# Altium schematic sheet 总电路图2.SchDoc
size A3; Organization: Altium Limited; Address1: L3, 12a Rodborough Rd; Address2: Frenchs Forest; Address3: NSW; Address4: Australia 2086
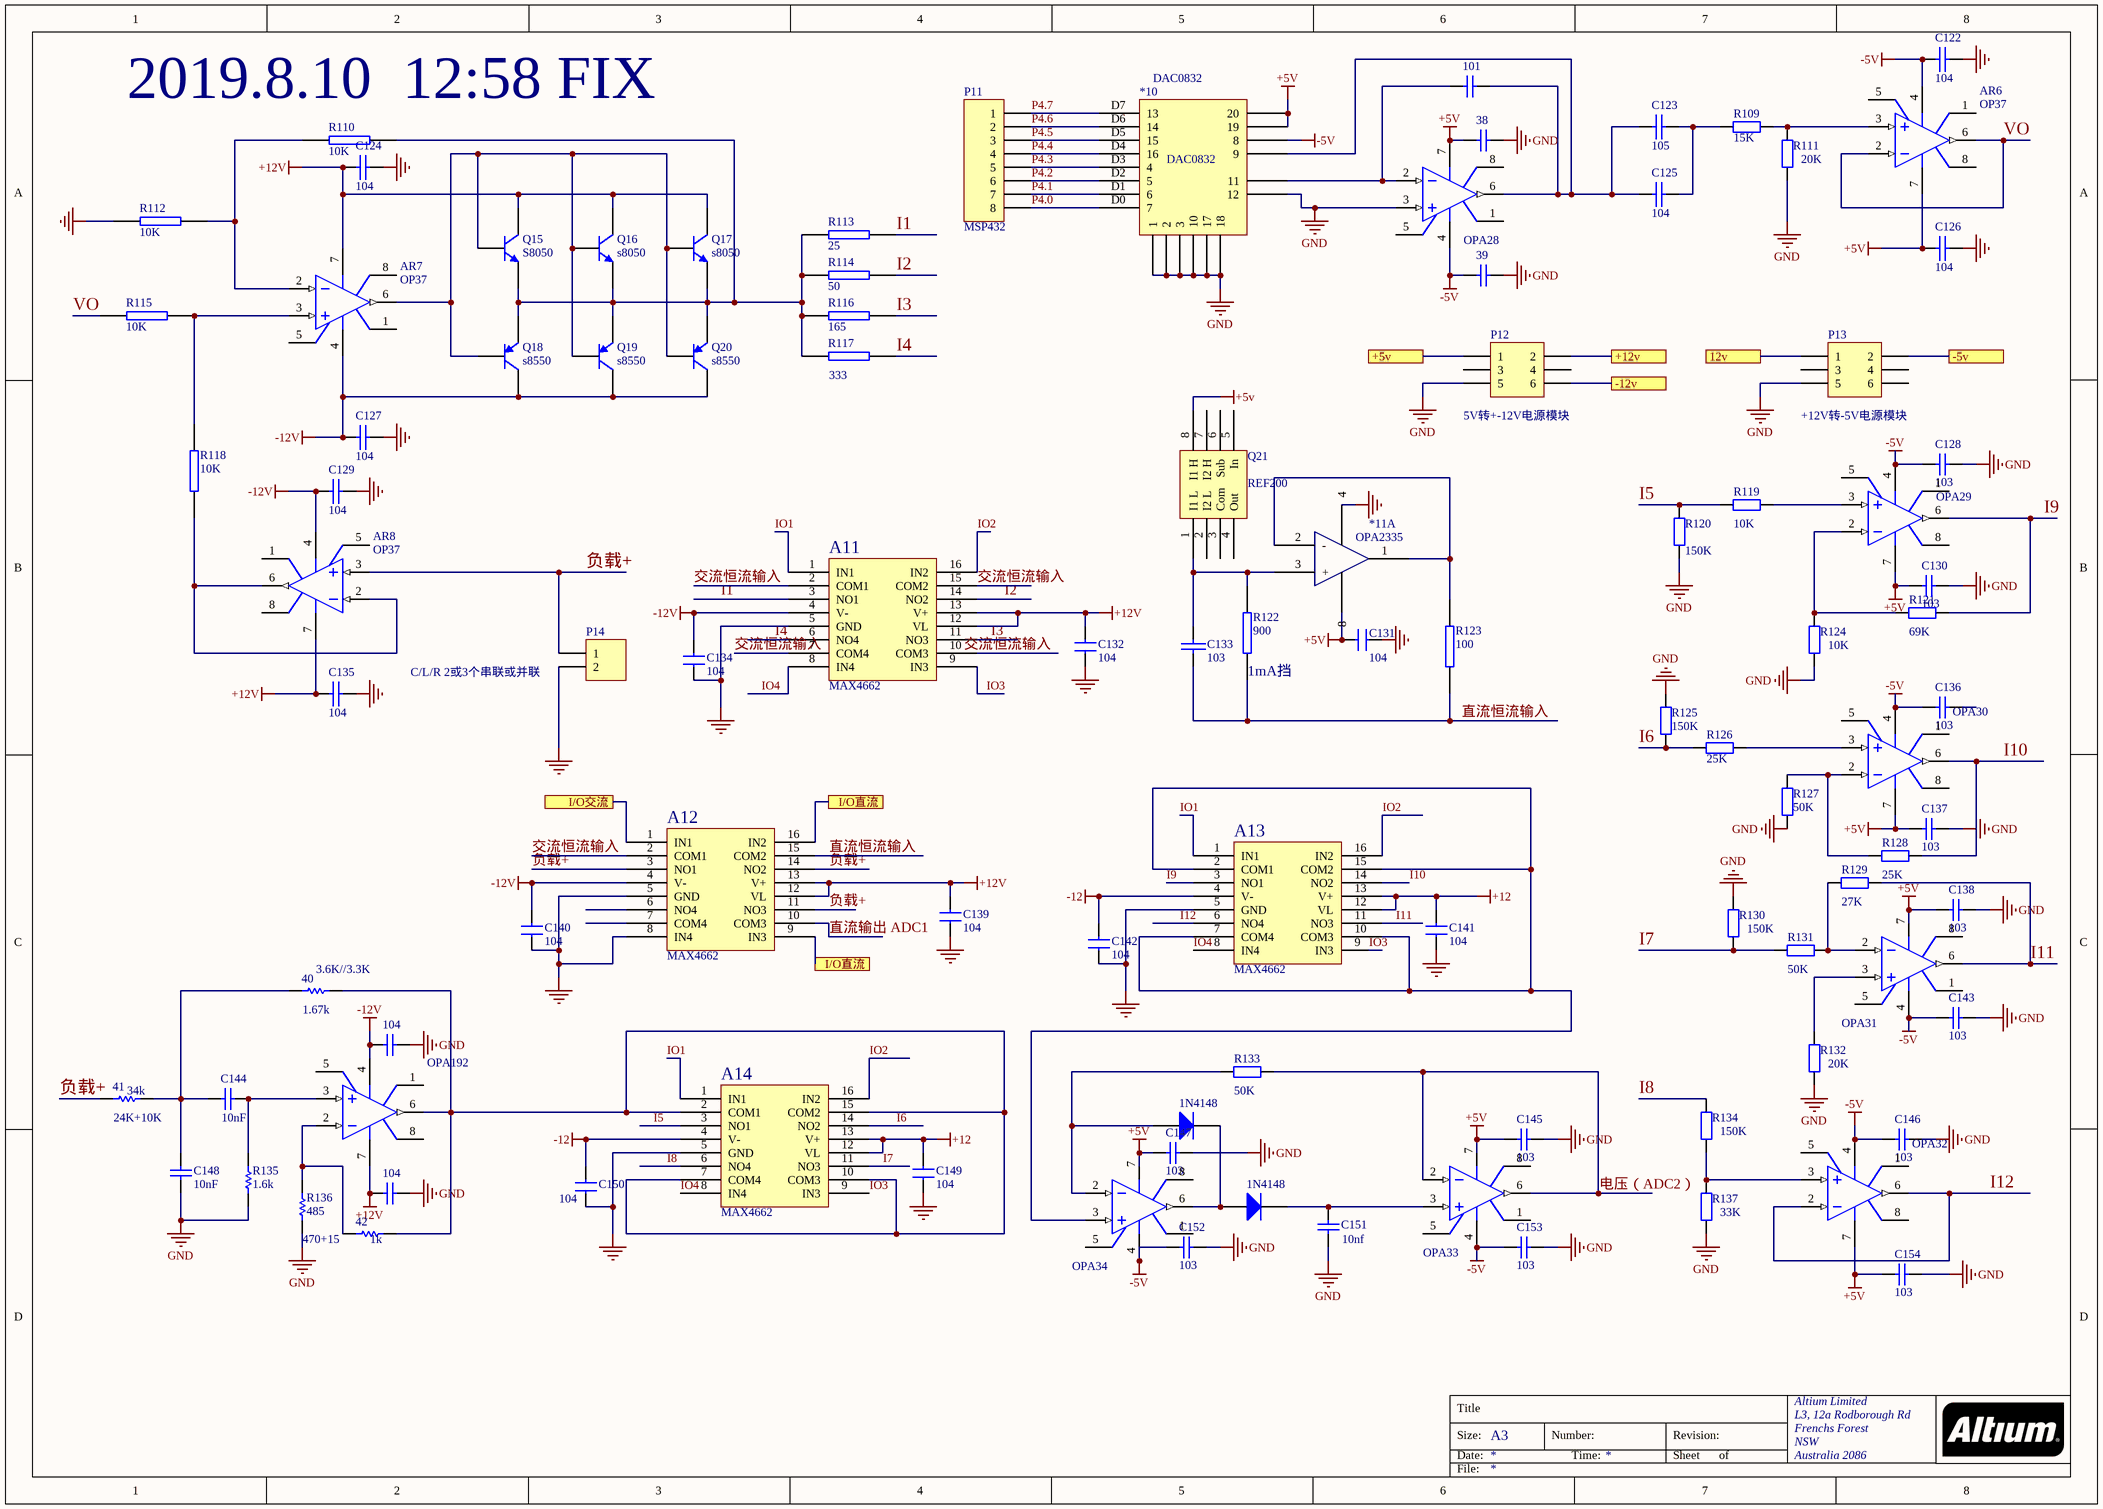
[diagram p0: 总电路图2.SchDoc]

## Parts
(Parts that share a designator on the sheet are numbered #1, #2 ... from top to bottom, then left to right.)
1N4148#1  Diode 1N4001  [DO-41]  (value not drawn)
1N4148#2  Diode 1N4001  [DO-41]  (value not drawn)
38  Cap  [RAD-0.3]  (value not drawn)
39  Cap  [RAD-0.3]  (value not drawn)
40  value 1.67k  [AXIAL-0.3]  (hidden comment: Res1)
41  value 34k  [AXIAL-0.3]  (hidden comment: Res1)
42  value 1k  [AXIAL-0.3]  (hidden comment: Res1)
101  Cap  [RAD-0.3]  (value not drawn)
104#1  Cap  [RAD-0.3]  (value not drawn)
104#2  Cap  [RAD-0.3]  (value not drawn)
*10  DAC0832
*11  OPA2335  (part A of 2)
A11  MAX4662  [DIP16-300_MH]
A12  MAX4662  [DIP16-300_MH]
A13  MAX4662  [DIP16-300_MH]
A14  MAX4662  [DIP16-300_MH]
AR6  OP37  [H-08A]
AR7  OP37  [H-08A]
AR8  OP37  [H-08A]
C122  104
C123  105
C124  104
C125  104
C126  104
C127  104
C128  value 103  [RAD-0.3]  (hidden comment: Cap)
C129  104
C130  value 103  [RAD-0.3]  (hidden comment: Cap)
C131  104  [RAD0.1]
C132  104  [RAD0.1]
C133  103
C134  104  [RAD0.1]
C135  104
C136  value 103  [RAD-0.3]  (hidden comment: Cap)
C137  value 103  [RAD-0.3]  (hidden comment: Cap)
C138  value 103  [RAD-0.3]  (hidden comment: Cap)
C139  104  [RAD0.1]
C140  104  [RAD0.1]
C141  104  [RAD0.1]
C142  104  [RAD0.1]
C143  value 103  [RAD-0.3]  (hidden comment: Cap)
C144  value 10nF  [RAD-0.3]  (hidden comment: Cap)
C145  value 103  [RAD-0.3]  (hidden comment: Cap)
C146  value 103  [RAD-0.3]  (hidden comment: Cap)
C147  value 103  [RAD-0.3]  (hidden comment: Cap)
C148  value 10nF  [RAD-0.3]  (hidden comment: Cap)
C149  104  [RAD0.1]
C150  104  [RAD0.1]
C151  value 10nf  [RAD-0.3]  (hidden comment: Cap)
C152  value 103  [RAD-0.3]  (hidden comment: Cap)
C153  value 103  [RAD-0.3]  (hidden comment: Cap)
C154  value 103  [RAD-0.3]  (hidden comment: Cap)
OPA28  Op Amp  [H-08A]  (value not drawn)
OPA29  Op Amp  [H-08A]  (value not drawn)
OPA30  Op Amp  [H-08A]  (value not drawn)
OPA31  Op Amp  [H-08A]  (value not drawn)
OPA32  Op Amp  [H-08A]  (value not drawn)
OPA33  Op Amp  [H-08A]  (value not drawn)
OPA34  Op Amp  [H-08A]  (value not drawn)
OPA192  Op Amp  [H-08A]  (value not drawn)
P11  MSP432  [HDR1X8]
P12  5V转+-12V电源模块  [HDR2X3]
P13  +12V转-5V电源模块  [HDR2X3]
P14  C/L/R 2或3个串联或并联  [HDR1X2H]
Q15  S8050  [TO-92A]
Q16  s8050  [TO-92A]
Q17  s8050  [TO-92A]
Q18  s8550  [TO-92A]
Q19  s8550  [TO-92A]
Q20  s8550  [TO-92A]
Q21  REF200
R109  value 15K  [AXIAL-0.4]  (hidden comment: Res2)
R110  10K  [RS 1/4W]
R111  value 20K  [AXIAL-0.4]  (hidden comment: Res2)
R112  10K  [RS 1/4W]
R113  25  [RS 1/4W]
R114  50  [RS 1/4W]
R115  10K  [RS 1/4W]
R116  165  [RS 1/4W]
R117  333  [RS 1/4W]
R118  10K  [RS 1/4W]
R119  value 10K  [AXIAL-0.4]  (hidden comment: Res2)
R120  value 150K  [AXIAL-0.4]  (hidden comment: Res2)
R121  value 69K  [AXIAL-0.4]  (hidden comment: Res2)
R122  900  [RS 1/4W]
R123  100  [RS 1/4W]
R124  value 10K  [AXIAL-0.4]  (hidden comment: Res2)
R125  value 150K  [AXIAL-0.4]  (hidden comment: Res2)
R126  value 25K  [AXIAL-0.4]  (hidden comment: Res2)
R127  value 50K  [AXIAL-0.4]  (hidden comment: Res2)
R128  value 25K  [AXIAL-0.4]  (hidden comment: Res2)
R129  value 27K  [AXIAL-0.4]  (hidden comment: Res2)
R130  value 150K  [AXIAL-0.4]  (hidden comment: Res2)
R131  value 50K  [AXIAL-0.4]  (hidden comment: Res2)
R132  value 20K  [AXIAL-0.4]  (hidden comment: Res2)
R133  value 50K  [AXIAL-0.4]  (hidden comment: Res2)
R134  value 150K  [AXIAL-0.4]  (hidden comment: Res2)
R135  value 1.6k  [AXIAL-0.3]  (hidden comment: Res1)
R136  value 485  [AXIAL-0.3]  (hidden comment: Res1)
R137  value 33K  [AXIAL-0.4]  (hidden comment: Res2)

## Ports
12v, +5v, +12v, -5v, -12v, I/O交流, I/O直流

## Nets
+5V: 38.1 *10.D14(20) *10.D15(19) AR6.7(V+) C126.1 C130.2 C131.1 C137.2 C138.2 C145.2 C147.2 C154.2 OPA28.7(V+) OPA29.7(V+) OPA30.7(V+) OPA31.7(V+) OPA32.7(V+) OPA33.7(V+) OPA34.7(V+) Q21.8(I1_H)
+12: A13.12(VL) A13.13(V+) A14.12(VL) A14.13(V+) C141.1 C149.1
+12V: 104#2.1 A11.12(VL) A11.13(V+) A12.12(VL) A12.13(V+) AR7.7(V+) AR8.7(V+) C124.1 C132.1 C135.1 C139.1 OPA192.7(V+) Q15.3(C) Q16.3(C) Q17.3(C)
-5V: 39.1 *10.D16(8) AR6.4(V-) C122.1 C128.2 C136.2 C143.2 C146.2 C152.2 C153.2 OPA28.4(V-) OPA29.4(V-) OPA30.4(V-) OPA31.4(V-) OPA32.4(V-) OPA33.4(V-) OPA34.4(V-)
-12: A13.4(V-) A14.4(V-) C142.2 C150.2
-12V: 104#1.1 A11.4(V-) A12.4(V-) AR7.4(V-) AR8.4(V-) C127.1 C129.1 C134.2 C140.2 OPA192.4(V-) Q18.3(C) Q19.3(C) Q20.3(C)
GND: 38.2 39.2 104#1.2 104#2.2 *10.D8(1) *10.D9(2) *10.D10(3) *10.D11(10) *10.D12(17) *10.D13(18) *10.D19(12) A11.5(GND) A12.5(GND) A12.8(IN4) A13.5(GND) A14.5(GND) C122.2 C124.2 C126.2 C127.2 C128.1 C129.2 C130.1 C131.2 C132.2 C134.1 C135.2 C137.1 C138.1 C139.2 C140.1 C141.2 C142.1 C143.1 C145.1 C146.1 C147.1 C148.1 C149.2 C150.1 C151.2 C152.1 C153.1 C154.1 OPA28.3(IN+) P12.5 P13.5 R111.1 R112.2 R120.2 R124.1 R125.2 R127.1 R130.2 R132.2 R135.1 R136.1 R137.2
12v: P13.1 ; port 12v
+5v: P12.1 ; port +5v  [a separate net that carries the same name]
+12v: P12.2 ; port +12v  [a separate net that carries the same name]
-5v: P13.2 ; port -5v  [a separate net that carries the same name]
-12v: P12.6 ; port -12v  [a separate net that carries the same name]
I1: A11.3(NO1) R113.2
I2: A11.14(NO2) R114.2
I3: A11.11(NO3) R116.2
I4: A11.6(NO4) R117.1
I5: A14.3(NO1) R119.1 R120.1
I6: A14.14(NO2) R125.1 R126.1
I7: A14.11(NO3) R130.1 R131.2
I8: A14.6(NO4) R134.1
I9: A13.3(NO1) OPA29.6(OUT) R121.1
I10: A13.14(NO2) OPA30.6(OUT) R128.1
I11: A13.11(NO3) OPA31.6(OUT) R129.1
I12: A13.6(NO4) OPA32.2(IN-) OPA32.6(OUT)
I/O交流: A12.1(IN1) ; port I/O交流
I/O直流: A12.9(IN3) A12.16(IN2) ; port I/O直流
IO1: A11.1(IN1) A13.1(IN1) A14.1(IN1)
IO2: A11.16(IN2) A13.16(IN2) A14.16(IN2)
IO3: A11.9(IN3) A13.9(IN3) A14.9(IN3)
IO4: A11.8(IN4) A13.8(IN4) A14.8(IN4)
P4.0: *10.D0(7) P11.8
P4.1: *10.D1(6) P11.7
P4.2: *10.D2(5) P11.6
P4.3: *10.D3(4) P11.5
P4.4: *10.D4(16) P11.4
P4.5: *10.D5(15) P11.3
P4.6: *10.D6(14) P11.2
P4.7: *10.D7(13) P11.1
VO: AR6.2(IN-) AR6.6(OUT) R115.1
交流恒流输入: A11.2(COM1) A11.7(COM4) A11.15(COM2) A12.2(COM1)
电压（ADC2）: OPA33.2(IN-) OPA33.6(OUT) R133.2
直流恒流输入: A12.15(COM2) C133.1 R122.1 R123.1
直流输出 ADC1: A12.10(COM3)
负载+: 41.1 A12.3(NO1) A12.11(NO3) A12.14(NO2) AR8.3(IN+) P14.1
Net1N4148#1_1: 1N4148#1.1(A) OPA34.2(IN-) R133.1
Net1N4148#1_2: 1N4148#1.2(K) 1N4148#2.1(A) OPA34.6(OUT)
Net1N4148#2_2: 1N4148#2.2(K) C151.1 OPA33.3(IN+)
Net40_1: 40.1 41.2 C144.1 C148.2
Net40_2: 40.2 42.2 A14.2(COM1) A14.7(COM4) A14.10(COM3) A14.15(COM2) OPA192.6(OUT)
Net42_1: 42.1 OPA192.2(IN-) R136.2
Net101_1: 101.1 *10.D18(11) OPA28.2(IN-)
Net101_2: 101.2 *10.D17(9) C123.2 C125.2 OPA28.6(OUT)
Net*11_1: *11.1 *11.2(-) R123.2
Net*11_3: *11.3(+) C133.2 Q21.1(I1_L) R122.2
NetA13_2: A13.2(COM1) A13.7(COM4) A13.10(COM3) A13.15(COM2) OPA34.3(IN+)
NetAR6_3: AR6.3(IN+) R109.1 R111.2
NetAR7_2: AR7.2(IN-) R110.1 R112.1
NetAR7_3: AR7.3(IN+) R115.2 R118.1
NetAR7_6: AR7.6(OUT) Q15.2(B) Q16.2(B) Q17.2(B) Q18.2(B) Q19.2(B) Q20.2(B)
NetAR8_2: AR8.2(IN-) AR8.6(OUT) R118.2
NetC123_1: C123.1 C125.1 R109.2
NetC144_2: C144.2 OPA192.3(IN+) R135.2
NetOPA29_2: OPA29.2(IN-) R121.2 R124.2
NetOPA29_3: OPA29.3(IN+) R119.2
NetOPA30_2: OPA30.2(IN-) R127.2 R128.2
NetOPA30_3: OPA30.3(IN+) R126.2
NetOPA31_2: OPA31.2(IN-) R129.2 R131.1
NetOPA31_3: OPA31.3(IN+) R132.1
NetOPA32_3: OPA32.3(IN+) R134.2 R137.1
NetQ15_1: Q15.1(E) Q16.1(E) Q17.1(E) Q18.1(E) Q19.1(E) Q20.1(E) R110.2 R113.1 R114.1 R116.1 R117.2

Not connected (* = marked no-connect by the designer): *11 ?1(4) ?2(8); A11 10(COM3); A12 6(NO4) 7(COM4); AR6 1(OS_NUL) 5(OS_NUL) 8(TAB); AR7 1(OS_NUL) 5(OS_NUL) 8(TAB); AR8 1(OS_NUL) 5(OS_NUL) 8(TAB); C136 1; OPA28 1(OS_NUL) 5(OS_NUL) 8(TAB); OPA29 1(OS_NUL) 5(OS_NUL) 8(TAB); OPA30 1(OS_NUL) 5(OS_NUL) 8(TAB); OPA31 1(OS_NUL) 5(OS_NUL) 8(TAB); OPA32 1(OS_NUL) 5(OS_NUL) 8(TAB); OPA33 1(OS_NUL) 5(OS_NUL) 8(TAB); OPA34 1(OS_NUL) 5(OS_NUL) 8(TAB); OPA192 1(OS_NUL) 5(OS_NUL) 8(TAB); P12 3 4; P13 3 4 6; P14 2; Q21 2(I2_L) 3(Com) 4(Out) 5(In) 6(Sub) 7(I2_H)

## Notes on the sheet
- (near R110) 2019.8.10  12:58 FIX
- (near R122) 1mA挡
- (near 40) 3.6K//3.3K
- (near 41) 24K+10K
- 470+15
- Labels drawn without touching a wire or pin: 交流恒流输入
- Title
- Size:
- Date:
- A3
- Number:
- Time:
- Revision:
- Sheet
- of
- File:

## Library data of the parts
1N4148#1 1N4148#2 = Diode 1N4001: 1 Amp General Purpose Rectifier; Published: 8-Jun-2000; LatestRevisionDate: 17-Jul-2002; LatestRevisionNote: Re-released for DXP Platform.; DatasheetVersion: 1998; PackageVersion: Aug-1999; PackageReference: DO-41; Publisher: Altium Limited; PackageDescription: Diode, Axial; Body 5.2 x 2.7 mm (LxDia. max), Lead Dia. 0.86 mm (max); Code_JEDEC: DO-204-AL; ComponentLink1Description: Manufacturer Link; ComponentLink1URL: http://www.fairchildsemi.com/; ComponentLink2Description: Datasheet; ComponentLink2URL: http://www.fairchildsemi.com/ds/1N%2F1N4001.pdf
38 39 101 104#1 104#2 = Cap: Capacitor; Value: 100pF; Published: 8-Jun-2000; LatestRevisionDate: 17-Jul-2002; LatestRevisionNote: Re-released for DXP Platform.; PackageReference: RAD-0.3; Publisher: Altium Limited; PackageDescription: Radial Cap, Thru-Hole; 2 Leads; 0.3 in Pin Spacing
40-42 R135 R136 = Res1: Resistor; Published: 8-Jun-2000; LatestRevisionDate: 17-Jul-2002; LatestRevisionNote: Re-released for DXP Platform.; PackageReference: AXIAL-0.3; Publisher: Altium Limited; PackageDescription: Axial Device, Thru-Hole; 2 Leads; 0.3 in Pin Spacing
*10 Q21 = Component_1
A11-A14 = MAX2662
AR6-AR8 OPA28-OPA34 OPA192 = Op Amp: FET Operational Amplifier; Published: 8-Jun-2000; LatestRevisionDate: 17-Jul-2002; LatestRevisionNote: Re-released for DXP Platform.; DatasheetVersion: REV. B; PackageVersion: 1990; PackageReference: H-08A; Publisher: Altium Limited; PackageDescription: Can; 8 Leads; Pin Circle Dia. 5.08 mm; Lead Dia. 0.53 mm (max); ComponentLink1Description: Manufacturer Link; ComponentLink1URL: http://www.analog.com/
C122-C127 C129 C131-C135 C139-C142 C149 C150 = CAP: Capacitor
  C131 C132 C134 C139-C142 C149 C150: Value: 104
C128 C130 C136-C138 C143-C148 C151-C154 = Cap: Capacitor; Published: 8-Jun-2000; LatestRevisionDate: 17-Jul-2002; LatestRevisionNote: Re-released for DXP Platform.; PackageReference: RAD-0.3; Publisher: Altium Limited; PackageDescription: Radial Cap, Thru-Hole; 2 Leads; 0.3 in Pin Spacing
P11 = Header 8: Header, 8-Pin; LatestRevisionDate: 17-Jul-2002; LatestRevisionNote: Re-released for DXP Platform.; Publisher: Altium Limited
P12 P13 = Header 3X2: Header, 3-Pin, Dual row; LatestRevisionDate: 17-Jul-2002; LatestRevisionNote: Re-released for DXP Platform.; Publisher: Altium Limited
P14 = Header 2H: Header, 2-Pin, Right Angle; LatestRevisionDate: 17-Jul-2002; LatestRevisionNote: Re-released for DXP Platform.; Publisher: Altium Limited
Q15-Q17 = 2N3904: NPN General Purpose Amplifier; Published: 8-Jun-2000; LatestRevisionDate: 15-Jan-2003; LatestRevisionNote: PCB Footprint 'BCY-W3/D4.7' replaced; DatasheetVersion: 1997; PackageVersion: Sep-1998; PackageReference: TO-92A; Publisher: Altium Limited; PackageDescription: TO, Flat Index; 3 In-Line, Axial Leads; Body Dia. 4.5mm; Leads 0.51 x 0.48 mm (max); ComponentLink1Description: Manufacturer Link; ComponentLink1URL: http://www.fairchildsemi.com/; ComponentLink2Description: Datasheet; ComponentLink2URL: http://www.fairchildsemi.com/ds/2N%2F2N3904.pdf
Q18-Q20 = 2N3906: PNP General Purpose Amplifier; Published: 8-Jun-2000; LatestRevisionDate: 15-Jan-2003; LatestRevisionNote: PCB Footprint 'BCY-W3/D4.7' replaced; DatasheetVersion: 1997; PackageVersion: Sep-1998; PackageReference: TO-92A; Publisher: Altium Limited; PackageDescription: TO, Flat Index; 3 In-Line, Axial Leads; Body Dia. 4.5mm; Leads 0.51 x 0.48 mm (max); ComponentLink1Description: Manufacturer Link; ComponentLink1URL: http://www.fairchildsemi.com/; ComponentLink2Description: Datasheet; ComponentLink2URL: http://www.fairchildsemi.com/ds/2N%2F2N3906.pdf
R109 R111 R119-R121 R124-R134 R137 = Res2: Resistor; Published: 8-Jun-2000; LatestRevisionDate: 17-Jul-2002; LatestRevisionNote: Re-released for DXP Platform.; PackageReference: AXIAL-0.4; Publisher: Altium Limited; PackageDescription: Axial Device, Thru-Hole; 2 Leads; 0.4 in Pin Spacing
R110 R112-R118 R122 R123 = RES2